# EAGLE design Adafruit Feather RP2040 Scorpio (EAGLE 9.6.2)
COMPANY: ADAFRUIT INDUSTRIES; DRAWN: KTOWN; REV: B
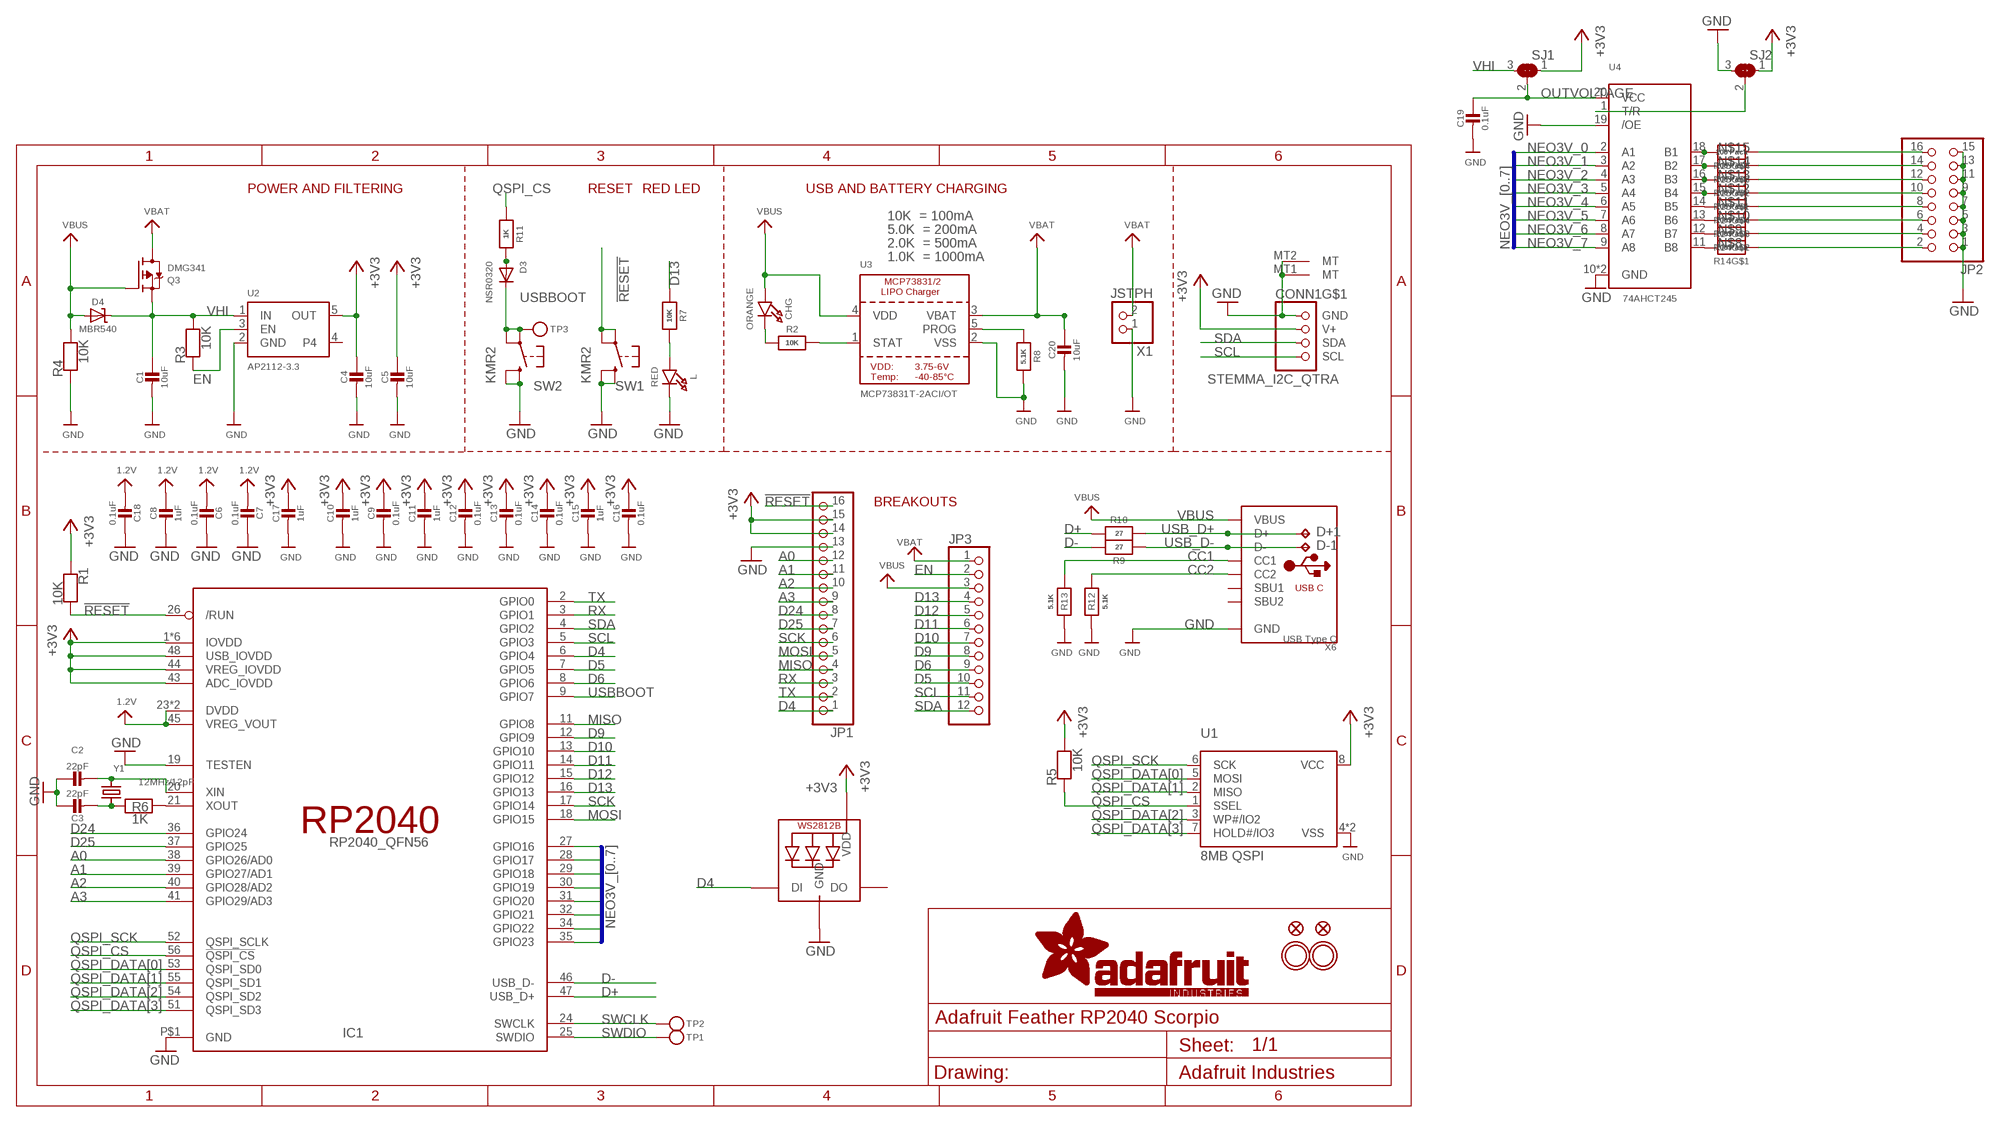
[diagram p0: schematic, sheet 1]

## Parts
C1  10uF  CAP_CERAMIC0805-NOOUTLINE  [0805-NO]
C2  22pF  CAP_CERAMIC_0402NO  [_0402NO]
C3  22pF  CAP_CERAMIC_0402NO  [_0402NO]
C4  10uF  CAP_CERAMIC0805-NOOUTLINE  [0805-NO]
C5  10uF  CAP_CERAMIC0805-NOOUTLINE  [0805-NO]
C6  0.1uF  CAP_CERAMIC_0402NO  [_0402NO]
C7  0.1uF  CAP_CERAMIC_0402NO  [_0402NO]
C8  1uF  CAP_CERAMIC0603_NO  [0603-NO]
C9  0.1uF  CAP_CERAMIC_0402NO  [_0402NO]
C10  1uF  CAP_CERAMIC0603_NO  [0603-NO]
C11  1uF  CAP_CERAMIC0603_NO  [0603-NO]
C12  0.1uF  CAP_CERAMIC_0402NO  [_0402NO]
C13  0.1uF  CAP_CERAMIC_0402NO  [_0402NO]
C14  0.1uF  CAP_CERAMIC_0402NO  [_0402NO]
C15  1uF  CAP_CERAMIC0603_NO  [0603-NO]
C16  0.1uF  CAP_CERAMIC_0402NO  [_0402NO]
C17  1uF  CAP_CERAMIC0603_NO  [0603-NO]
C18  0.1uF  CAP_CERAMIC_0402NO  [_0402NO]
C19  0.1uF  CAP_CERAMIC_0402NO  [_0402NO]
C20  10uF  CAP_CERAMIC0805-NOOUTLINE  [0805-NO]
CHG  ORANGE  LED0603_NOOUTLINE  [CHIPLED_0603_NOOUTLINE]
CONN1  STEMMA_I2C_QTRA  [JST_SH4_RA]
D3  NSR0320  DIODESOD-323F  [SOD-323F]
D4  MBR540  DIODE-SCHOTTKYSOD-123  [SOD-123]
D+1  TPB1,27  [B1,27]
D-1  TPB1,27  [B1,27]
IC1  RP2040_QFN56  [QFN56_7MM_REDUCEDEPAD]
JP1  HEADER-1X16ROUND  [1X16_ROUND]
JP2  HEADER-2X8  [2X08]
JP3  HEADER-1X12  [1X12_ROUND]
L  RED  LED0603_NOOUTLINE  [CHIPLED_0603_NOOUTLINE]
LED1  WS2812B_SK6805_1515  [SK6805_1515]
Q3  DMG341  MOSFET-P  [SOT23-R]
R1  10K  RESISTOR_0603_NOOUT  [0603-NO]
R2  10K  RESISTOR_0603_NOOUT  [0603-NO]
R3  10K  RESISTOR_0603_NOOUT  [0603-NO]
R4  10K  RESISTOR_0603_NOOUT  [0603-NO]
R5  10K  RESISTOR_0603_NOOUT  [0603-NO]
R6  1K  RESISTOR_0603_NOOUT  [0603-NO]
R7  10K  RESISTOR_0603_NOOUT  [0603-NO]
R8  5.1K  RESISTOR_0603_NOOUT  [0603-NO]
R9  27  RESISTOR_0603_NOOUT  [0603-NO]
R10  27  RESISTOR_0603_NOOUT  [0603-NO]
R11  1K  RESISTOR_0603_NOOUT  [0603-NO]
R12  5.1K  RESISTOR_0603_NOOUT  [0603-NO]
R13  5.1K  RESISTOR_0603_NOOUT  [0603-NO]
R14  100 Pack  RESISTOR_4PACK_0804  [RESPACK_4X0402]
R15  100 Pack  RESISTOR_4PACK_0804  [RESPACK_4X0402]
SJ1  SOLDERJUMPER_2WAY  [SOLDERJUMPER_2WAY_OPEN_NOPASTE]
SJ2  SOLDERJUMPER_2WAY  [SOLDERJUMPER_2WAY_OPEN_NOPASTE]
SW1  KMR2  SWITCH_TACT_SMT4.6X2.8  [BTN_KMR2_4.6X2.8]
SW2  KMR2  SWITCH_TACT_SMT4.6X2.8  [BTN_KMR2_4.6X2.8]
TP1  TESTPOINTROUND1.5MMNO  [TESTPOINT_ROUND_1.5MM_NO]
TP2  TESTPOINTROUND1.5MMNO  [TESTPOINT_ROUND_1.5MM_NO]
TP3  TESTPOINTROUND1.5MMNO  [TESTPOINT_ROUND_1.5MM_NO]
U1  8MB QSPI  SPIFLASH_8PIN_4X4  [USON8_4X4]
U2  AP2112-3.3  VREG_SOT23-5  [SOT23-5]
U3  MCP73831T-2ACI/OT  MCP73831/2  [SOT23-5]
U4  74AHCT245  74LCX245_QFN20  [20-DHVQFN]
U$31  MOUNTINGHOLE2.5  [MOUNTINGHOLE_2.5_PLATED]
U$32  MOUNTINGHOLE2.5  [MOUNTINGHOLE_2.5_PLATED]
U$34  FIDUCIAL_1MM  [FIDUCIAL_1MM]
U$35  FIDUCIAL_1MM  [FIDUCIAL_1MM]
X1  JSTPH  CON_JST_PH_2PIN_BATT  [JSTPH2_BATT]
X6  USB Type C  USB_C  [USB_C_CUSB31-CFM2AX-01-X]
Y1  12MHz/12pF  CRYSTAL2.5X2.0  [CRYSTAL_2.5X2]

## Nets
1.2V: C6.2 C7.2 C8.1 C18.2 IC1.23(DVDD) IC1.45(VREG_VOUT) IC1.50(DVDD)
!RESET: IC1.26(/RUN) JP1.16 R1.2 SW1.A'(P1) SW1.A(P)
+3V3: C4.1 C5.1 C9.1 C10.1 C11.1 C12.1 C13.1 C14.1 C15.1 C16.1 C17.1 CONN1.2(V+) IC1.1(IOVDD) IC1.10(IOVDD) IC1.22(IOVDD) IC1.33(IOVDD) IC1.42(IOVDD) IC1.43(ADC_IOVDD) IC1.44(VREG_IOVDD) IC1.48(USB_IOVDD) IC1.49(IOVDD) JP1.14 JP1.15 LED1.2(VDD) R1.1 R5.2 SJ1.1 SJ2.1 U1.8(VCC) U2.5(OUT)
A0: IC1.38(GPIO26/AD0) JP1.12
A1: IC1.39(GPIO27/AD1) JP1.11
A2: IC1.40(GPIO28/AD2) JP1.10
A3: IC1.41(GPIO29/AD3) JP1.9
CC1: R13.2 X6.A5(CC1)
CC2: R12.2 X6.B5(CC2)
D4: IC1.6(GPIO4) JP1.1 LED1.1(DI)
D5: IC1.7(GPIO5) JP3.10
D6: IC1.8(GPIO6) JP3.9
D9: IC1.12(GPIO9) JP3.8
D10: IC1.13(GPIO10) JP3.7
D11: IC1.14(GPIO11) JP3.6
D12: IC1.15(GPIO12) JP3.5
D13: IC1.16(GPIO13) JP3.4 R7.1
D24: IC1.36(GPIO24) JP1.8
D25: IC1.37(GPIO25) JP1.7
D+: IC1.47(USB_D+) R10.2
D-: IC1.46(USB_D-) R9.2
EN: JP3.2 R3.1 U2.3(EN)
GND [power]: C1.2 C2.1 C3.1 C4.2 C5.2 C6.1 C7.1 C8.2 C9.2 C10.2 C11.2 C12.2 C13.2 C14.2 C15.2 C16.2 C17.2 C18.1 C19.2 C20.2 CONN1.1(GND) CONN1.MT1(MT) CONN1.MT2(MT) IC1.19(TESTEN) IC1.P$1(GND) JP1.13 JP2.1 JP2.3 JP2.5 JP2.7 JP2.9 JP2.11 JP2.13 JP2.15 L.C LED1.4(GND) R4.1 R8.2 R12.1 R13.1 SJ2.3 SW1.B'(S1) SW1.B(S) SW2.B'(S1) SW2.B(S) U1.4(VSS) U1.PAD(VSS) U2.2(GND) U3.2(VSS) U4.10(GND) U4.19(/OE) U4.21(GND) X1.1 X6.A1B12(GND) X6.B1A12(GND)
MISO: IC1.11(GPIO8) JP1.4
MOSI: IC1.18(GPIO15) JP1.5
N$1: CHG.C R2.1
N$2: L.A R7.2
N$3: R2.2 U3.1(STAT)
N$4: R8.1 U3.5(PROG)
N$5: C2.2 IC1.20(XIN) Y1.3
N$6: C3.2 R6.1 Y1.1
N$7: IC1.21(XOUT) R6.2
N$8: R14.8 U4.11(B8)
N$9: R14.7 U4.12(B7)
N$10: R14.6 U4.13(B6)
N$11: R14.5 U4.14(B5)
N$12: R15.8 U4.15(B4)
N$13: R15.7 U4.16(B3)
N$14: R15.6 U4.17(B2)
N$15: R15.5 U4.18(B1)
N$16: D3.A R11.2
N$19: SJ2.2 U4.1(T/R)
NEO0: JP2.16 R15.4
NEO1: JP2.14 R15.3
NEO2: JP2.12 R15.2
NEO3: JP2.10 R15.1
NEO3V_0: IC1.27(GPIO16) U4.2(A1)
NEO3V_1: IC1.28(GPIO17) U4.3(A2)
NEO3V_2: IC1.29(GPIO18) U4.4(A3)
NEO3V_3: IC1.30(GPIO19) U4.5(A4)
NEO3V_4: IC1.31(GPIO20) U4.6(A5)
NEO3V_5: IC1.32(GPIO21) U4.7(A6)
NEO3V_6: IC1.34(GPIO22) U4.8(A7)
NEO3V_7: IC1.35(GPIO23) U4.9(A8)
NEO4: JP2.8 R14.4
NEO5: JP2.6 R14.3
NEO6: JP2.4 R14.2
NEO7: JP2.2 R14.1
OUTVOLTAGE: C19.1 SJ1.2 U4.20(VCC)
QSPI_CS: IC1.56(!QSPI_CS) R5.1 R11.1 U1.1(SSEL)
QSPI_DATA[0]: IC1.53(QSPI_SD0) U1.5(MOSI)
QSPI_DATA[1]: IC1.55(QSPI_SD1) U1.2(MISO)
QSPI_DATA[2]: IC1.54(QSPI_SD2) U1.3(WP#/IO2)
QSPI_DATA[3]: IC1.51(QSPI_SD3) U1.7(HOLD#/IO3)
QSPI_SCK: IC1.52(QSPI_SCLK) U1.6(SCK)
RX: IC1.3(GPIO1) JP1.3
SCK: IC1.17(GPIO14) JP1.6
SCL: CONN1.4(SCL) IC1.5(GPIO3) JP3.11
SDA: CONN1.3(SDA) IC1.4(GPIO2) JP3.12
SWCLK: IC1.24(SWCLK) TP2.P$1
SWDIO: IC1.25(SWDIO) TP1.P$1
TX: IC1.2(GPIO0) JP1.2
USB_D+: D+1.TP R10.1 X6.A6(D+) X6.B6(D+)
USB_D-: D-1.TP R9.1 X6.A7(D-) X6.B7(D-)
USBBOOT: D3.C IC1.9(GPIO7) SW2.A'(P1) SW2.A(P) TP3.P$1
VBAT [power]: C20.1 JP3.1 Q3.3(D) U3.3(VBAT) X1.2
VBUS [power]: CHG.A D4.A JP3.3 Q3.1(G) R4.2 U3.4(VDD) X6.A4B9(VBUS) X6.B4A9(VBUS)
VHI: C1.1 D4.C Q3.2(S) R3.2 SJ1.3 U2.1(IN)
Unconnected: LED1.3(DO) U2.4 X6.A8(SBU1) X6.B8(SBU2)

## Buses
NEO3V_[0..7]

## Notes on the sheet
- POWER AND FILTERING | RESET | RED LED | USB AND BATTERY CHARGING
- 10K  = 100mA
- 5.0K  = 200mA
- 2.0K  = 500mA
- 1.0K  = 1000mA
- BREAKOUTS

## Library data of the parts
C1-C3 C5-C20 = microbuilder:CAP_CERAMIC: Ceramic Capacitors For new designs, use the packages preceded by an '_' character since they are more reliable: The following footprints should be used on most boards: _0402 - Standard footprint for regular board layouts _0603 - Standard footprint for regular board layouts _0805 - Standard footprint for regular board layouts _1206 - Standard footprint for regular board layouts For extremely tight-pitch boards where space is at a premium, the following 'micro-pitch' footprints can be used (smaller pads, no silkscreen outline, etc.): _0402MP - Micro-pitch footprint for very dense/compact boards _0603MP - Micro-pitch footprint for very dense/compact boards _0805MP - Micro-pitch footprint for very dense/compact boards _1206MP - Micro-pitch footprint for very dense/compact boards
C4 = microbuilder:CAP_CERAMIC: Ceramic Capacitors For new designs, use the packages preceded by an '_' character since they are more reliable: The following footprints should be used on most boards: _0402 - Standard footprint for regular board layouts _0603 - Standard footprint for regular board layouts _0805 - Standard footprint for regular board layouts _1206 - Standard footprint for regular board layouts For extremely tight-pitch boards where space is at a premium, the following 'micro-pitch' footprints can be used (smaller pads, no silkscreen outline, etc.): _0402MP - Micro-pitch footprint for very dense/compact boards _0603MP - Micro-pitch footprint for very dense/compact boards _0805MP - Micro-pitch footprint for very dense/compact boards _1206MP - Micro-pitch footprint for very dense/compact boards; REV: A
CHG L = microbuilder:LED: LED 0603 - 0603 Surface Mount Package 2mA: Green LED - Low Power (3.9mcd, 2ma, 1.7Vf) - Digikey: 475-2709-2-ND Orange LED - Low Power (9.8mcd, 2ma, 1.8Vf) - Digikey: 475-1194-2-ND Red LED - Low Power (5mcd, 2ma, 1.8Vf) - Digikey: 475-1195-2-ND Yellow LED - Low Power (7mcd, 2ma, 1.8Vf) - Digikey: 475-1196-2-ND 5mA: Blue LED - Low Power (17mcd, 5ma, 2.9Vf) - Digikey: LNJ937W8CRACT-ND 0805 - 0805 Surface Mount Package 2mA: Red LED (8.8mcd, 2mA, 1.8Vf, Clear) - Low Power [Digikey: 475-2510-1-ND] Green LED (5mcd, 2mA, 1.8Vf, Clear) - Low Power [Digikey: 475-2730-1-ND] Yellow LED (11.3mcd, 2mA, 1.8Vf, Clear) - Low Power [Digikey: 475-2555-1-ND] 20mA: Red LED (104mcd, 20mA, Diffused) - LS R976 [Digikey: 475-1278-6-ND] Red LED (12mcd, 20mA, 2.0Vf, Clear) - APT2012EC [Digikey: 754-1128-1-ND] Green LED (15mcd, 20mA, 2.2Vf, Clear) - APT2012GC [Digikey: 754-1131-1-ND] Orange LED (160mcd, 20mA, 2.1Vf, Clear) - APT2012SECK [Digikey: 754-1130-1-ND] 1206 - 1206 Surface Mount Package Green LED (26mcd, 20mA, Diffused) - LG N971 [Digikey: 475-1407-6-ND] Red LED (15mcd, 20mA, Diffused) - LH N974 [Digikey: 475-1416-6-ND] Cree - Cree High-Power Surface Mount LEDs XPEBWT-L1-0000-00D50 - White 111lm 350mA 2.9Vf 6200K 110° XTEAWT-00-0000-00000LEE3 - White 114lm 350mA 2.85Vf 5000K 115° Everlight - Everlight 45-21 Series Surface Mount LEDs 45-21/QK2C-B2832AC2CB2/2T - Warm White 2000mcd 20mA 3.25Vf 3050K 120° 45-21/LK2C-B38452C4CB2/2T - Nuetral White 2000mcd 20mA 3.25Vf 4150K 120° 45-21/LK2C-B50634C6CB2/2T - Cold White 2200mcd 20mA 3.25Vf 5650K 120° PLCC2 Reverse Mount LS T77K-J1L2-1-0-2-R18-Z - Red 11.25mcd 2mA 1.8Vf 630nm 120° LO T77K-L1M2-24-Z - Orange 19.6mcd 2mA 1.8Vf 606nm 120° LY T77K-K2M1-26-Z - Yellow 15.7mcd 2mA 1.8Vf 587nm 120°; ROT: 270
CONN1 = adafruit_electromech:STEMMA_I2C; LCSC: C145961
D3 = adafruit:DIODE: Diode SMADIODE - SMA Surface Mount Package 20V 1A Schottky Diode Digikey: 641-1014-6-ND DO-1N4148 - Through Hole Small Current Diode SOD-123 20V 1 A (.5mV Vf) Schottky Diode - Digikey: MBRX120TPMSCT-ND SOD-323 10V 570mA (.38mV Vf, 3ns) Schottky Diode - Digikey: ZLLS410CT-ND SOD-523 30V 30mA Schottky Diode (RB751S-40TE61) - Digikey: RB751S-40TE61CT-ND SOT23-R/W - SOT23 Package (R = Solder Paste/Reflow Ovens, W = Hand-Soldering) BAT54Film 40V 300mA - Digikey: 497-7162-1-ND
D4 = microbuilder:DIODE-SCHOTTKY
D+1 D-1 = testpad:TP: Test pad
IC1 = adafruit_micro:RP2040; LCSC: C2040
JP1 = microbuilder:HEADER-1X16: PIN HEADER
JP2 = microbuilder:HEADER-2X8
JP3 = microbuilder:HEADER-1X12
LED1 = microbuilder:WS2812B; LCSC: C2890035
Q3 = microbuilder:MOSFET-P: P-Channel Mosfet LEGEND VDS: Voltage Drain-Source ID: Drain Current RDS(ON): Drain-Source On-State Resistance VGS(TH): Gate-Source Threshold Voltage CISS: Drain-Source Input Capacitance SOT-23 Name VDS ID RDS(ON) VGS(TH) CISS Order Number IRLML5103 30V 760mA 600 mOhm -- 75pF @ 25V Digikey: IRLML5103PBFCT-ND IRLML6401 12V 4.3A 50 mOhm 950mV @ 250µA 830pF @ 10V Digikey: IRLML6401PBFTR-ND NTR0202PL 20V 400mA 800 mOhm 2.3V @ 250uA 70pF @ 5V Digikey: NTR0202PLT1GOSTR-ND NTR4101PT1G 20V 1.8A 85 mOhm 1.2V @ 250uA 675pF @ 10V Digikey: NTR4101PT1GOSCT-ND DMP2004K 20V 600mA 900 mOhm 1V @ 250uA 175pF @ 16V Digikey: DMP2004KDICT-ND PMV65XP 20V 3.9A 76 mOhm 950mV @ 1mA 725pF @ 20V Digikey: 568-2358-2-ND TO-252 Name VDS ID RDS(ON) VGS(TH) CISS Order Number AOD417 30V 25A 34 mOhm 3V @ 250µA 920pF @ 15V Digikey: 785-1106-2-ND PowerPak Name VDS ID RDS(ON) VGS(TH) CISS Order Number AON7401 30V 12A 14 mOhm 3V @ 250µA 2600pF @ 15V Digikey: 785-1302-1-ND
R1-R13 = microbuilder:RESISTOR: Resistors For new designs, use the packages preceded by an '_' character since they are more reliable: The following footprints should be used on most boards: _0402 - Standard footprint for regular board layouts _0603 - Standard footprint for regular board layouts _0805 - Standard footprint for regular board layouts _1206 - Standard footprint for regular board layouts For extremely tight-pitch boards where space is at a premium, the following 'micro-pitch' footprints can be used (smaller pads, no silkscreen outline, etc.): _0402MP - Micro-pitch footprint for very dense/compact boards _0603MP - Micro-pitch footprint for very dense/compact boards _0805MP - Micro-pitch footprint for very dense/compact boards _1206MP - Micro-pitch footprint for very dense/compact boards
R14 R15 = microbuilder:RESISTOR_4PACK: Resistor Packs (4 resistors) 4 x 0603 10K 1/16W - Digikey: YC164J-10KCT-ND
SJ1 SJ2 = microbuilder:SOLDERJUMPER_2WAY: 2-Way Solder Jumper
SW1 SW2 = adafruit_electromech:SWITCH_TACT_SMT: SMT Tact Switches 6x6mm - Digikey: P12940SCT-ND KMR2 (4.6x2.8mm) - Digikey: 401-1426-1-ND EVQ-PQHB55 - Light Touch, 160GF (4.5x4.5mm) - Digikey: P8090SCT-ND KMT0 - KMT021 NGJ LHS (etc.) IP68/Waterproof - Digikey: CKN10289CT-ND
TP1-TP3 = microbuilder:TESTPOINT: Test Point Various test points for characterisation and PCB testing TESTPOINT_SMT - Compact Surface Mount Test Point [Digikey: 5016KTR-ND]
U1 = microbuilder:SPIFLASH_8PIN: SOIC8 SPI Flash Be careful with the size since SOIC8 flash comes in several 'widths' SOIC8 150 mil M25P16 - 16Mbit (2Mbit x 8) Serial Flash (75MHz SPI Bus), Supply: 2.7-3.6V Digikey: SOIC8 - M25P16-VMN6P-ND SOIC8 208 mil W25Q16BVSSIG - 16Mbit (2Mbit x 8) Serial Flash (104MHz SPI Bus), Supply: 2.7-3.6V Digikey: SOIC8 - W25Q16BVSSIG-ND
U2 = adafruit_power:VREG_SOT23-5: SOT23-5 Fixed Voltage Regulators Part Current Out V Out V In V Dropout θJA (°C/W) TJ (°C) Digikey Part No. ADP121 150mA 3.3V 3.4-5.5V 0.09V @ 150mA -- -- ADP121-AUJZ33R7CT-ND ADP121 150mA 3.0V 3.1-5.5V 0.09V @ 150mA -- -- ADP121-AUJZ30R7CT-ND ADP122 300mA 3.3V 3.4-5.5V 0.085V @ 300mA -- -- ADP122AUJZ-3.3-R7CT-ND ADP1712 300mA 3.3V 3.5-5.5V 0.17V @ 300mA -- -- ADP1712AUJZ-3.3-R7TR-ND AP7311 (Low Cost) 150mA 3.3V 3.5-6V 0.15V @ 150mA -- -- AP7311-33WG-7DICT-ND LD39015M18R 150mA 1.8V 1.9V-5.5V 0.08V @ 100mA -- -- 497-6977-1-ND LP2985A-33DBVR 150mA 3.3V 3.3-16V 0.28V @ 150mA 206 150 296-18479-1-ND MCP1824T-3302E/OT 300mA 3.3V 3.5V-6V 0.2V @ 300mA -- -- MCP1824T-3302E/OTCT-ND MIC5205-2.5YM5 TR 150mA 2.5V 2.7-16V 0.165V @ 150mA -- -- 576-1257-2-ND MIC5205-3.0YM5 TR 150mA 3.0V 3.2V-16V 0.165V @ 150mA -- -- 576-1258-2-ND MIC5205-3.3YM5 TR 150mA 3.3V 3.5V-16V 0.165V @ 150mA -- -- 576-1259-2-ND TPS780330220 150mA 3.3V+2.2V 3.6-5.5V 250mV Max -- -- 296-23332-1-ND TDA3663/N1,135 100mA 3.3V 3.5-45V 0.18V @ 50mA -- -- 568-5343-1-ND Max operating temp can be calculated using θJA, TJ (max junction temperature), and power in watts. Set the "Maximum Ambient Temperature" until it reaches TJ ("Max Junction Temperature"), which is the absolute limit for safe use of the regulator: Heat Sink Temperature Calculator <http://www.daycounter.com/Calculators/Heat-Sink-Temperature-Calculator.phtml> For example, With 12V source into a 3.3V LP2985 and a 30mA load, we are dissipating (12V-3.3V) * 0.03A = 0.261W. With a θJA of 206 °C/W, a TJ of 150°C, and 261mW we can safely use the chip without a heat sink up to 75°C (=147.1°C Junction Temperature).; JLC_ROTATION: 0
U3 = microbuilder:MCP73831/2: MCP73831/2 LIPO Charger VDD: 3.75 - 6V Temp -40 - 85°C Programmable Charge Rate: 15-500mA NOTE: STAT is a tri-state logic output on the MCP73831 and an open-drain output on the MCP73832. SOT23-5 with 4.2V output and tri-state logic on STAT = MCP73831T-2ACI/OT; JLC_ROTATION: 270; LCSC: C424093
U4 = microbuilder:74LCX245: 74LCX245MTC - 5.0V Tolerant Bi-Directional Buffer Can be used to interface 5.0V logic to 2.5 or 3.3V devices Digikey: 74LCX245MTCXTR-ND Mouser: 512-74LCX245MTCX
U$31 U$32 = adafruit_electromech:MOUNTINGHOLE: Mounting Hole For #2 screws (0.086"/2.18mm width, 0.094"/2.4mm hole) use 2.5mm; BOM: EXCLUDE
U$34 U$35 = microbuilder:FIDUCIAL: Fiducial Alignment Points Various fiducial points for machine vision alignment.; BOM: EXCLUDE
X1 = adafruit_electromech:CON_JST_PH_2PIN: JST 2-Pin Right-Angle Connector PH-Series - 4UConnector: 17311 SH-Series - 4UConnector: 07278; LCSC: C47647
X6 = adafruit_electromech:USB_C: USB Type-C USB 2.0 Connector; LCSC: C165948
Y1 = microbuilder:CRYSTAL: Crystals HC49UP - Surface Mount Crystal 4.0MHz 18pF +/-30ppm Surface Mount Crystal [Digikey: 535-9857-1-ND] 12.0 MHz Surface Mount Crystal [Digikey: 535-9869-6-ND] 25.0 MHz Surface Mount Crystal [Digikey: 535-9078-1-ND] 2.5 x 2.0mm - MEMs SMT Crystal 16.0 MHz 10pF 20ppm 2.5 x 2.0mm Crystal [Digikey -40-85°C: 535-10923-1-ND] 3.2 x 2.5mm - MEMs SMT Crystal 12.0 MHz 8pF 15ppm 3.2 x 2.5mm Crystal [Digikey: -10-70°C: 644-1047-1-ND -40-125°C: 644-1128-1-ND] 40~85°C cheaper: 644-1173-6-ND 16.0 MHz 8pF 15ppm 3.2 x 2.5mm Crystal [Digikey: -10-70°C: 644-1049-1-ND -40-125°C: 644-1129-2-ND]-40~85°C cheaper: 644-1175-6-ND 16.0 MHz 10pF 10ppm 3.2 x 2.5mm Crystal [Digikey: 644-1100-1-ND] 27.12 MHz 18pF 30ppm 3.2 x 2.5mm Crystal [Digikey: 887-1424-1-ND] 27.12MHz 10pF 10ppm 3.2 x 2.5mm Crystal [Digikey: 887-1329-1-ND] 4.9 x 1.8mm - MEMs SMT Crystal 32.768 KHz 12.5pF 20ppm 4.9 x 1.8mm Crystal [Digikey: SE2415CT-ND] 8.0 x 3.8mm - Surface Mount Crystal 32.768kHz 12.5pF 20ppm -40°C-85°C [Digikey: 535-9166-2-ND] Cylinder 32.768KHz Cylinder Crystal (2x6mm body) [Ex. Digikey: 300-8341-2-ND]

## Net classes
1 power: width 0.305 mm
2 gnd: width 0.254 mm

## Board
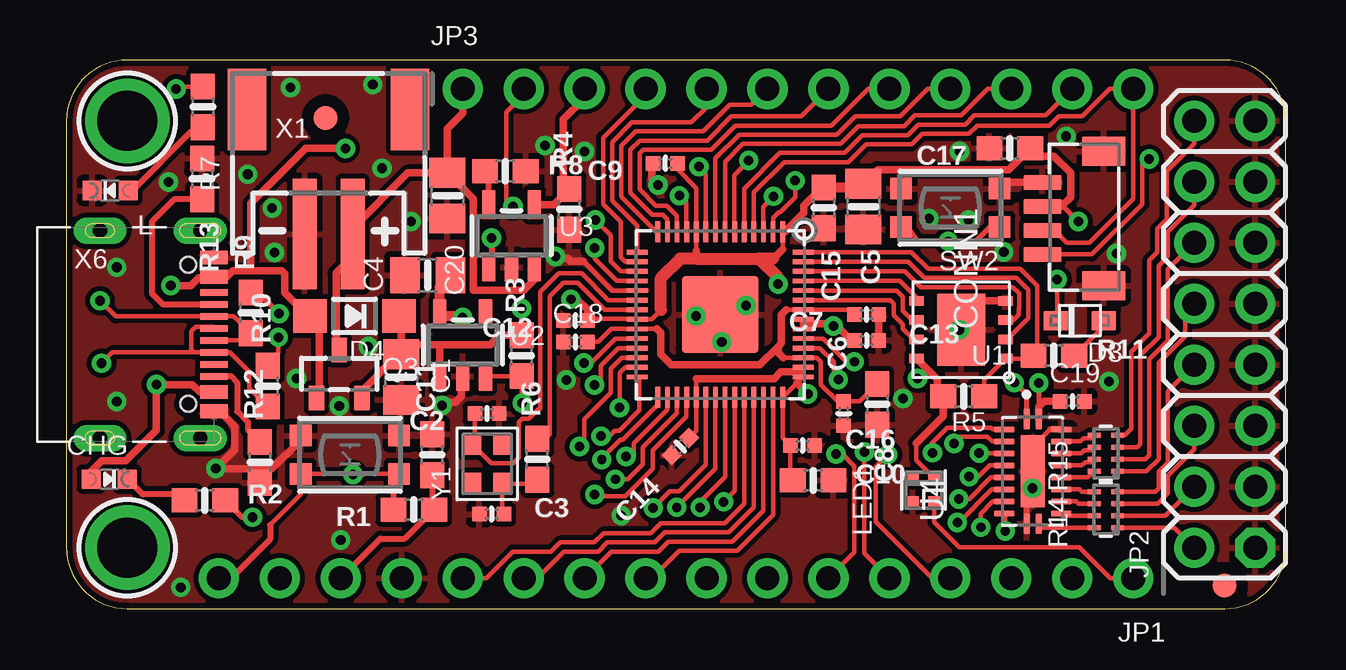
[diagram p1: board, top side]
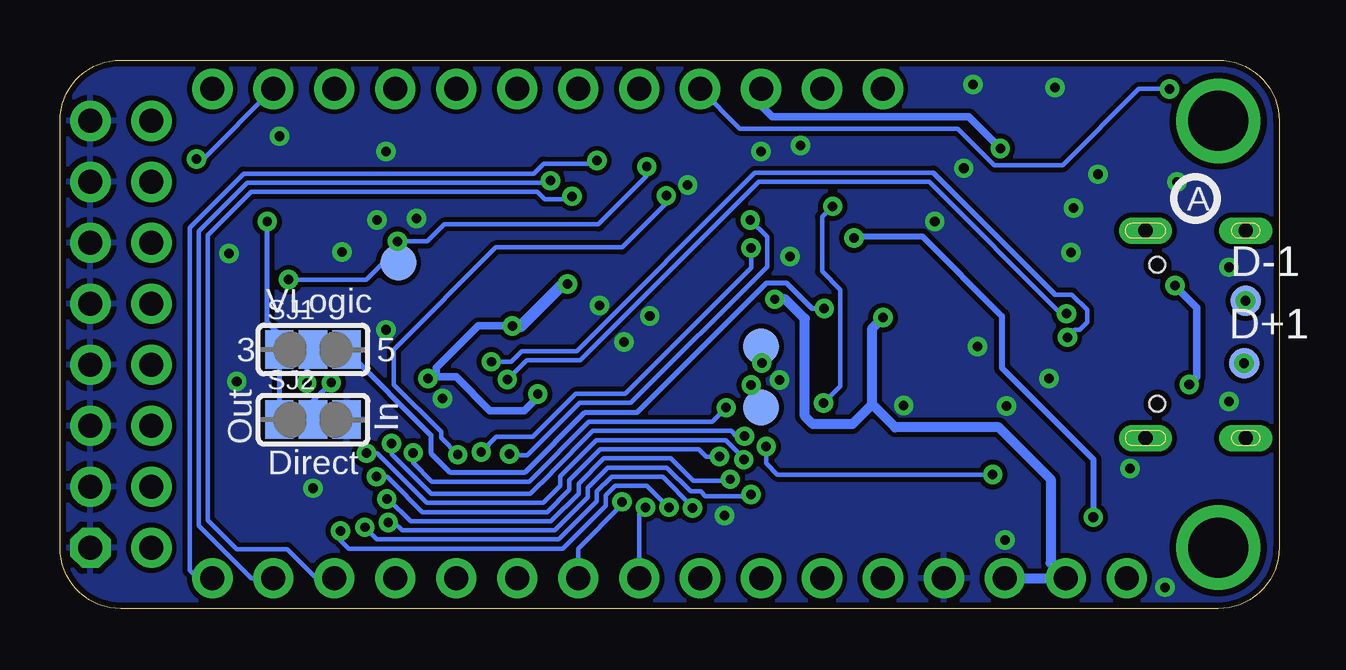
[diagram p2: board, bottom side, seen from below]

Size 50.8 x 22.86 mm. Coordinates in mm from the lower left corner, seen from the top.
Outline: 2.54,0 48.26,0 arc90 50.8,2.54 50.8,20.32 arc90 48.26,22.86 2.54,22.86 arc90 0,20.32 0,2.54 arc90 2.54,0
Copper layers (1*16): Top 0.035mm / dielectric 1.5mm / Bottom 0.035mm
Design rules "adafruit 7-7 *": minimum track width 7mil, minimum drill 15.5mil, track to track 8mil, track to pad 7mil, pad to pad 7mil, via to via 7mil, smd to smd 7mil, copper to edge 10mil, drill to drill 8mil, minimum pad ring 10mil, minimum via ring 8mil, stop-mask expansion 2mil, vias tented up to drill 20mil, thermal gap 10mil

### Footprints (pad centres in the part's own frame; a part is rotated, then mirrored left to right if it is on the bottom)
0805-NO = smd 1.24 x 1.5: 1 -0.95,0; 2 0.95,0
_0402NO = smd 0.6 x 0.6: 1 -0.508,0; 2 0.508,0
0603-NO = smd 1.075 x 1: 1 -0.85,0; 2 0.85,0
CHIPLED_0603_NOOUTLINE = smd 0.8 x 0.8: A 0,-0.75; C 0,0.75
JST_SH4_RA = smd 0.6 x 1.55: 1 1.5,0.924; 2 0.5,0.924; 3 -0.5,0.924; 4 -1.5,0.924 | smd 1.2 x 1.8: MT1 -2.8,-1.624; MT2 2.8,-1.624
SOD-323F = smd 1 x 0.8: A -1,0; C 1,0
SOD-123 = smd 1.4 x 1.4: A 1.85,0; C -1.85,0
B1,27 = smd 1.27 x 1.27: TP 0,0
QFN56_7MM_REDUCEDEPAD = smd 0.875 x 0.2: 1 -3.45,2.6; 2 -3.45,2.2; 3 -3.45,1.8; 4 -3.45,1.4; 5 -3.45,1; 6 -3.45,0.6; 7 -3.45,0.2; 8 -3.45,-0.2; 9 -3.45,-0.6; 10 -3.45,-1; 11 -3.45,-1.4; 12 -3.45,-1.8; 13 -3.45,-2.2; 14 -3.45,-2.6; 29 3.45,-2.6; 30 3.45,-2.2; 31 3.45,-1.8; 32 3.45,-1.4; 33 3.45,-1; 34 3.45,-0.6; 35 3.45,-0.2; 36 3.45,0.2; 37 3.45,0.6; 38 3.45,1; 39 3.45,1.4; 40 3.45,1.8; 41 3.45,2.2; 42 3.45,2.6 | smd 0.2 x 0.875: 15 -2.6,-3.45; 16 -2.2,-3.45; 17 -1.8,-3.45; 18 -1.4,-3.45; 19 -1,-3.45; 20 -0.6,-3.45; 21 -0.2,-3.45; 22 0.2,-3.45; 23 0.6,-3.45; 24 1,-3.45; 25 1.4,-3.45; 26 1.8,-3.45; 27 2.2,-3.45; 28 2.6,-3.45; 43 2.6,3.45; 44 2.2,3.45; 45 1.8,3.45; 46 1.4,3.45; 47 1,3.45; 48 0.6,3.45; 49 0.2,3.45; 50 -0.2,3.45; 51 -0.6,3.45; 52 -1,3.45; 53 -1.4,3.45; 54 -1.8,3.45; 55 -2.2,3.45; 56 -2.6,3.45 | smd 3.2 x 3.2: P$1 0,0
1X16_ROUND = drill 1 pad 1.676: 1 -19.05,0; 2 -16.51,0; 3 -13.97,0; 4 -11.43,0; 5 -8.89,0; 6 -6.35,0; 7 -3.81,0; 8 -1.27,0; 9 1.27,0; 10 3.81,0; 11 6.35,0; 12 8.89,0; 13 11.43,0; 14 13.97,0; 15 16.51,0; 16 19.05,0
2X08 = drill 1 pad 1.676 octagon: 1 -8.89,-1.27 | drill 1 pad 1.676: 2 -8.89,1.27; 3 -6.35,-1.27; 4 -6.35,1.27; 5 -3.81,-1.27; 6 -3.81,1.27; 7 -1.27,-1.27; 8 -1.27,1.27; 9 1.27,-1.27; 10 1.27,1.27; 11 3.81,-1.27; 12 3.81,1.27; 13 6.35,-1.27; 14 6.35,1.27; 15 8.89,-1.27; 16 8.89,1.27
1X12_ROUND = drill 1 pad 1.676: 1 -13.97,0; 2 -11.43,0; 3 -8.89,0; 4 -6.35,0; 5 -3.81,0; 6 -1.27,0; 7 1.27,0; 8 3.81,0; 9 6.35,0; 10 8.89,0; 11 11.43,0; 12 13.97,0
SK6805_1515 = smd 0.5 x 0.5: 1 -0.5,-0.45; 2 0.5,-0.45; 3 0.5,0.45; 4 -0.5,0.45
SOT23-R = smd 0.635 x 1.016: 1 -0.95,-1; 2 0.95,-1; 3 0,1
RESPACK_4X0402 = smd 0.203 x 0.533: 1 -0.75,-0.486; 2 -0.25,-0.486; 3 0.25,-0.486; 4 0.75,-0.486; 5 0.75,0.486; 6 0.25,0.486; 7 -0.25,0.486; 8 -0.75,0.486
SOLDERJUMPER_2WAY_OPEN_NOPASTE = smd 1.168 x 1.6: 1 -1.397,0; 2 0,0; 3 1.397,0
BTN_KMR2_4.6X2.8 = smd 0.9 x 0.9: A 2.05,0.8; A' -2.05,0.8; B 2.05,-0.8; B' -2.05,-0.8
TESTPOINT_ROUND_1.5MM_NO = smd 1.5 x 1.5: P$1 0,0
USON8_4X4 = smd 0.6 x 0.4: 1 -1.85,1.2; 2 -1.85,0.4; 3 -1.85,-0.4; 4 -1.85,-1.2; 5 1.85,-1.2; 6 1.85,-0.4; 7 1.85,0.4; 8 1.85,1.2 | smd 2 x 3: PAD 0,0
SOT23-5 = smd 0.55 x 1.2: 1 -0.95,-1.3; 2 0,-1.3; 3 0.95,-1.3; 4 0.95,1.3; 5 -0.95,1.3
20-DHVQFN = smd 0.26 x 0.86: 1 -0.25,2.185; 10 -0.25,-2.185; 11 0.25,-2.185; 20 0.25,2.185 | smd 0.86 x 0.26: 2 -1.185,1.75; 3 -1.185,1.25; 4 -1.185,0.75; 5 -1.185,0.25; 6 -1.185,-0.25; 7 -1.185,-0.75; 8 -1.185,-1.25; 9 -1.185,-1.75; 12 1.185,-1.75; 13 1.185,-1.25; 14 1.185,-0.75; 15 1.185,-0.25; 16 1.185,0.25; 17 1.185,0.75; 18 1.185,1.25; 19 1.185,1.75 | smd 1 x 3: 21 0,0
MOUNTINGHOLE_2.5_PLATED = drill 2.5 pad 3.2: P$1 0,0
FIDUCIAL_1MM = smd 1 x 1: 1 0,0
JSTPH2_BATT = smd 1 x 4.6: 1 -1,-2.049; 2 1,-2.049 | smd 1.6 x 3.4: NC1 -3.4,3.151; NC2 3.4,3.151
USB_C_CUSB31-CFM2AX-01-X = smd 0.575 x 1.15: A1B12 -3.2,2.275; A4B9 -2.4,2.275; B1A12 3.2,2.275; B4A9 2.4,2.275 | smd 0.275 x 1.15: A5 -1.25,2.275; A6 -0.25,2.275; A7 0.25,2.275; A8 1.25,2.275; B5 1.75,2.275; B6 0.75,2.275; B7 -0.75,2.275; B8 -1.75,2.275 | drill 0.6 pad 1 long: M1 -4.32,1.7; M2 4.32,1.7; M3 -4.32,-2.48; M4 4.32,-2.48 | hole 0.65: 2.89,1.2; -2.89,1.2
CRYSTAL_2.5X2 = smd 0.9 x 0.75: 1 -0.825,-0.625; 2 0.825,-0.625; 3 0.825,0.625; 4 -0.825,0.625

### Placement (x,y rotation side)
C1  13.95,9.65 270 top
C2  17.53,8.13 180 top
C3  17.72,3.94 0 top
C4  15.05,13.89 180 top
C5  33.21,16.75 270 top
C6  32.38,8.13 90 top
C7  33.34,12.26 180 top
C8  33.78,8.51 270 top
C9  24.96,18.55 180 top
C10  31.11,5.34 0 top
C11  15.24,6.41 90 top
C12  21.21,12 180 top
C13  33.34,11.18 0 top
C14  25.58,6.76 225 top
C15  31.56,16.7 270 top
C16  30.67,6.79 0 top
C17  39.31,19.18 180 top
C18  21.21,11.11 0 top
C19  41.91,8.64 0 top
C20  15.88,17.21 270 top
CHG  1.78,5.4 270 top
CONN1  41.59,16.26 90 top
D3  42.23,12 180 top
D4  12,12.19 180 top
D+1  1.46,10.22 0 bottom
D-1  1.4,12.83 0 bottom
IC1  27.24,12.26 270 top
JP1  25.4,1.27 180 top
JP2  48.26,11.43 90 top
JP3  30.48,21.65 0 top
L  1.82,17.42 90 top
LED1  35.71,4.94 90 top
Q3  11.37,9.78 0 top
R1  14.48,4.13 180 top
R2  5.77,4.51 0 top
R3  18.96,10.54 90 top
R4  20.95,16.64 90 top
R5  37.39,8.84 180 top
R6  19.62,6.22 90 top
R7  5.69,20.9 270 top
R8  18.29,18.22 0 top
R9  7.68,12.32 90 top
R10  8.38,9.27 90 top
R11  41.15,10.54 0 top
R12  8.06,6.1 90 top
R13  5.65,17.91 270 top
R14  43.31,4.13 90 top
R15  43.31,6.48 90 top
SJ1  40.26,10.79 0 bottom
SJ2  40.26,7.87 0 bottom
SW1  11.81,6.41 180 top
SW2  36.83,16.7 180 top
TP1  21.59,8.38 0 bottom
TP2  21.59,10.92 0 bottom
TP3  36.7,14.41 0 bottom
U1  37.27,11.62 180 top
U2  16.51,10.99 0 top
U3  18.54,15.53 0 top
U4  40.26,5.71 0 top
U$12  [SCORPIO_TOP]  0,0 0 top
U$13  [PCBFEAT-REV-040]  3.49,17.08 0 bottom
U$28  [SCORPIO_BOT]  50.8,0.06 0 bottom
U$31  2.54,20.32 270 top
U$32  2.54,2.54 270 top
U$34  10.79,20.45 270 top
U$35  48.24,0.96 270 top
X1  10.92,17.65 0 top
X6  3.87,11.43 270 top
Y1  17.53,6.03 90 top

### Tracks (layer width: path | path; a pad name or v marks a point on that pad's centre or on a via)
1.2V
  Top 0.178: C7.2 32.63,12.46 IC1.50 29.99,12.46 | 29.87,10.46 IC1.45 31.25,10.46 31.43,10.28 31.43,9.34 32.13,8.64 C6.2 33.06,8.64 C8.1 | C18.2 22.16,11.11 22.7,11.65 IC1.23 24.6,11.65
  Top 0.305: 29.99,12.46 29.78,12.25 29.78,11.05 29.65,10.92 | 29.87,10.46 29.65,10.67 29.65,10.92 | 29.65,10.92 28.89,10.16 25.21,10.16 24.77,10.6 24.77,11.49 24.6,11.65
!RESET  (via drill 0.39, 0.4)
  Top 0.178: 12.38,5.61 SW1.A 9.76,4.77 8.48,3.49 | 12.38,5.61 SW1.A' | v11.94,5.59 12.36,5.59 12.38,5.61 | v21.38,6.75 21.57,6.95 21.57,7.9 22.67,9 22.67,9.99 23.14,10.46 IC1.26
  Top 0.254: JP1.16 6.86,1.27 8.48,2.9 8.48,3.49 | R1.2 13.63,5.38 SW1.A'
  Bottom 0.178: v21.38,6.75 21.38,6.06 20.91,5.59 v11.94,5.59
+3V3  (via drill 0.39, 0.4)
  Top 0.178: C9.1 25.46,18.3 26.24,17.52 IC1.10 26.24,14.91 | C10.1 30.16,5.44 C16.1 29.84,7.12 IC1.42 30.43,9.39 IC1.43 IC1.44 30.69,9.99 30.56,9.87 | C15.1 31.56,17.42 | 29.84,14.98 IC1.1 29.86,15.68 29.91,15.68 | C5.1 33.13,17.62 | IC1.48 IC1.49 30.69,11.87 | 32.69,17.55 32.72,17.58 | C17.1 40.47,18.86 | R5.2 36.4,8.84 | C14.1 26.24,7.42 IC1.33 26.24,9.59 | C12.1 21.79,12.07 23.77,12.07 IC1.22 24.38,12.06 24.77,12.44 | v21.02,12.89 21.27,12.89 | LED1.2 35.42,6.18 35.42,6.89
  Top 0.203: v42.16,16.13 41.54,16.76 41.46,16.76
  Top 0.254: JP1.14 13.08,2.92 14.1,2.92 15.3,4.13 R1.1 15.24,4.21 C11.1 | 35.56,9.59 v35.47,9.59
  Top 0.305: U2.5 15.65,12.19 | 16.45,12.19 v16.51,12.13 | 15.56,13.45 C4.1 | 29.84,14.98 29.45,14.59 | CONN1.2 41.46,16.76 41.85,17.14 41.85,18.16 41.15,18.86 40.47,18.86 | C5.1 33.8,18.29 39.27,18.29 C17.1 | 36.4,8.84 36.28,8.95 36.28,9.56 35.91,9.94 | 31.95,11.87 30.69,11.87 | C13.1 32.7,11.18 31.95,11.93 31.95,11.87 | 30.56,9.87 29.77,9.87 29.5,9.59 26.24,9.59 | 31.95,11.87 v31.95,11.78 | C12.1 21.72,12.45 21.27,12.89 | 26.24,14.91 26.24,14.61 26.23,14.59 | 29.91,15.68 30.73,16.5 30.73,16.78 31.37,17.42 31.56,17.42 | 30.43,9.39 30.45,9.39 v30.89,8.94 | U1.8 35.91,9.94 | 35.91,9.94 35.56,9.59 | R5.2 36.54,8.01 35.42,6.89
  Top 0.406: 16.45,12.19 15.65,12.19 | U2.5 15.56,13.45 | 32.72,17.58 33.13,17.62 | C15.1 32.69,17.55
  Top 0.508: 29.45,14.59 28.84,14.59 | v29.65,13.53 29.65,13.78 28.84,14.59 | 24.77,12.44 24.77,13.78 25.57,14.59 26.23,14.59 28.84,14.59
  Bottom 0.178: v31.95,11.78 31.59,11.78
  Bottom 0.203: v42.16,16.13 42.16,11.94 41.66,11.43 SJ1.1 SJ2.1
  Bottom 0.305: v30.89,8.94 30.89,8.82 31.45,8.26 32.89,8.26 34.29,9.65 35.12,9.65 | v31.95,11.78 33.37,11.78 35.12,10.03 35.12,9.65 | 35.12,9.65 35.4,9.65 v35.47,9.59
  Bottom 0.406: v16.51,12.13 16.95,11.68 16.95,8.51 | JP1.14 JP1.15 9.53,1.91 9.53,5.4 11.68,7.56 16,7.56 16.95,8.51 | 16.95,8.51 17.78,7.68 19.43,7.68 19.77,8.02 19.77,12.08 20.57,12.89 v21.02,12.89
  Bottom 0.508: 31.59,11.78 29.84,13.53 v29.65,13.53
A0
  Top 0.178: IC1.38 28.24,4.36 27.43,3.56 24.77,3.56 24.35,3.14 22.38,3.14 22,2.76 20.57,2.76 20.19,2.38 18.59,2.38 17.49,1.27 JP1.12
A1
  Top 0.178: IC1.39 28.64,4.22 27.59,3.17 24.93,3.17 24.51,2.76 22.54,2.76 22.16,2.38 20.73,2.38 19.56,1.21 19.11,1.21 JP1.11
A2
  Top 0.178: IC1.40 29.04,4.09 27.75,2.79 25.08,2.79 24.66,2.38 22.7,2.38 JP1.10
A3
  Top 0.178: IC1.41 29.44,3.91 27.94,2.41 25.53,2.41 24.38,1.27 JP1.9
CC1
  Top 0.254: R13.2 4.48,17.06 3.56,16.13 3.56,13.14 4.02,12.68 X6.A5
CC2
  Top 0.254: X6.B5 6.84,9.7 7.11,9.42 7.11,8.22 7.56,7.77 7.56,7.45 R12.2
D4  (via drill 0.39)
  Top 0.178: IC1.6 27.82,15.72 27.82,18.07 v28.43,18.67 | LED1.1 36.16,3.6 37.2,2.56 42.2,2.56 43.5,1.27 JP1.1
  Bottom 0.178: JP1.1 45.08,1.27 45.4,1.59 45.4,15.87 43.15,18.13 31.06,18.13 30.65,18.54 29.08,18.54 28.55,18.54 v28.43,18.67
D5
  Top 0.178: IC1.7 27.44,18.63 28.18,19.37 32.26,19.37 33,20.1 34.9,20.1 35.34,20.55 37.29,20.55 38.39,21.65 JP3.10
D6
  Top 0.178: JP3.9 35.88,21.65 34.73,20.51 32.87,20.51 32.11,19.75 28.02,19.75 27.04,18.77 IC1.8
D9
  Top 0.178: JP3.8 33.4,21.65 31.88,20.13 27.87,20.13 26.86,19.12 24.04,19.12 23.88,18.96 23.88,17.48 24.56,16.8 25,16.8 25.42,16.38 25.42,15.72 IC1.12
D10
  Top 0.178: JP3.7 30.61,20.51 27.71,20.51 26.7,19.5 23.88,19.5 23.5,19.12 23.5,17.32 24.41,16.41 24.85,16.41 25.04,16.22 IC1.13
D11
  Top 0.178: JP3.6 28.54,20.99 27.64,20.99 26.54,19.88 23.72,19.88 23.12,19.28 23.12,17.16 24.58,15.71 IC1.14
D12
  Top 0.178: IC1.15 23.79,15.95 22.74,17 22.74,19.44 23.56,20.26 26.04,20.26 26.67,20.9 JP3.5
D13  (via drill 0.39)
  Top 0.178: IC1.16 23.28,14.46 23.09,14.64 23.09,16.12 22.36,16.85 22.36,19.63 24.13,21.4 JP3.4 | R7.1 4.67,21.75 v4.57,21.65
  Bottom 0.178: JP3.4 22.48,20 13.4,20 11.87,18.48 9.02,18.48 5.84,21.65 v4.57,21.65
D24  (via drill 0.39)
  Top 0.178: IC1.36 27.44,5.5 26.41,4.46 v26.41,4.22
  Bottom 0.178: v26.41,4.22 26.67,3.96 JP1.8
D25  (via drill 0.39)
  Top 0.178: IC1.37 27.84,4.91 v27.38,4.45
  Bottom 0.178: v27.38,4.45 27.38,4.32 29.21,2.5 JP1.7
D+  (via drill 0.39, 0.4)
  Top 0.178: v8.83,11.31 8.83,10.67 8.38,10.22 R10.2 | v32.83,10.29 32.5,10.29 31.53,11.26 IC1.47
  Bottom 0.178: 14.41,18.16 21.84,18.16 29.27,10.73 31.56,10.73 32,10.29 v32.83,10.29 | v8.83,11.31 8.51,11.62 8.32,11.62 8,11.94 8,12.45 8.64,13.08 9.34,13.08
  Bottom 0.203: 14.41,18.16 9.34,13.08
D-  (via drill 0.39, 0.4)
  Top 0.178: v32.16,9.55 31.97,9.74 31.97,10.28 31.39,10.86 IC1.46
  Top 0.203: v8.86,12.29 7.98,13.17 R9.2
  Bottom 0.178: v32.16,9.55 31.36,10.35 29.12,10.35 21.69,17.78 14.59,17.78 9.1,12.29 v8.86,12.29
EN  (via drill 0.39)
  Top 0.178: JP3.2 19.05,21.39 18.33,20.68 18.33,16.76 v18.61,16.76 | U2.3 18.73,9.69 18.74,9.69 R3.1 18.96,8.6 v18.99,8.57
  Bottom 0.178: v18.61,16.76 19.05,16.32 19.05,14.05 18.29,13.29 18.29,9.27 v18.99,8.57
GND  (via drill 0.39, 0.4)
  Top 0.178: IC1.19 22.75,13.26 21.53,14.48 | 40.99,7.46 40.07,6.54
  Top 0.203: 40.01,5.96 U4.21
  Top 0.254: U4.19 40.99,7.46 | 40.26,6.6 U4.21 40.01,5.46 U4.10
  Top 0.305: U2.2 16.45,9.62 16.45,8.86 16.19,8.61 15.65,8.61 v15.65,8.47 | SW1.B 9.76,7.02 8.56,5.82 6.22,5.82 7.01,6.61 7.01,7.59 6.26,8.34 X6.B1A12 | v24.65,17.65 24.38,17.92 24.38,18.49 C9.2 | 21.53,14.48 21.02,14.48 20.89,14.61 20.45,14.61 v20.38,14.67 | CONN1.1 38.88,17.76 SW2.B' | C7.1 C13.2 | U1.4 37.66,12.82 37.66,12.83 37.27,12.45 U1.PAD
  other vias: 11.37,8.45 14.35,16.13 8.57,16.7 6.22,5.84 9.33,21.72 12.76,21.84 12.57,10.92 7.56,18.1 8.67,14.85 9.59,9.59 2.1,8.64 2.1,14.22 11.43,2.86 19.94,19.3 21.59,19.05 26.23,12.19 28.32,12.64 27.3,11.11 23.11,3.87 35.94,16.26 37.59,16.19 41.66,19.68 37.21,19.05 37.21,11.62 34.86,8.76 43.75,14.8 43.43,9.46 20.83,9.53 40.26,5.02 4.76,0.89 4.25,17.78 13.14,18.35 39.05,14.86
  pour Top: 0,22.86 50.8,22.86 50.8,0 0,0
  pour Bottom: 0,22.86 50.86,22.86 50.86,0 0,0
MISO  (via drill 0.39)
  Top 0.178: IC1.11 25.82,15.72 25.82,16.96 25.57,17.21 v25.54,17.21 | JP1.4 36.07,1.27 33.72,3.62 33.72,5.91 v34.23,6.41
  Bottom 0.178: v34.23,6.41 34.92,7.11 34.92,7.37 36.89,9.34 36.89,10.79 32.64,15.05 27.38,15.05 25.54,16.89 v25.54,17.21
MOSI  (via drill 0.39)
  Top 0.178: IC1.18 22.93,13.65 22.01,14.58 v22.01,15.03 | JP1.5 33.25,2.31 v33.25,6.53
  Bottom 0.178: v22.01,15.03 22.01,14.2 27.26,8.95 29.3,8.95 31.1,7.16 32.61,7.16 v33.25,6.53
N$1
  Top 0.254: R2.1 4.66,4.76 3.18,4.76 2.54,5.4 CHG.C
N$2
  Top 0.254: R7.2 5.52,19.89 5.2,19.89 2.74,17.42 L.A
N$3  (via drill 0.4)
  Top 0.254: v7.75,3.81 7.31,3.81 R2.2 | v17.72,15.44 17.72,14.65 17.59,14.53 U3.1
  Bottom 0.254: v7.75,3.81 7.75,6.22 11.56,10.03 11.56,12.19 14.87,15.51 17.65,15.51 v17.72,15.44
N$4
  Top 0.254: R8.1 17.57,18.1 17.57,16.86 U3.5
N$5
  Top 0.178: C2.2 17.02,6.97 Y1.3 17.71,6.05 18.61,6.05 18.86,6.3 18.86,7.77 18.99,7.91 19.26,7.91 19.68,8.32 19.75,8.32 19.75,13.21 20.51,13.97 21.46,13.97 22.58,12.86 IC1.20
N$6
  Top 0.178: R6.1 19.62,5.21 Y1.1 18.15,4.01 C3.2
N$7
  Top 0.178: R6.2 19.93,7.07 20.13,7.27 20.13,13.02 20.7,13.59 21.3,13.59 22.44,12.46 IC1.21
N$8
  Top 0.178: U4.11 40.66,3.38 R14.8
N$9
  Top 0.178: U4.12 41.53,3.88 R14.7
N$10
  Top 0.178: U4.13 42.08,4.46 42.17,4.38 R14.6
N$11
  Top 0.178: U4.14 42.22,4.96 42.3,4.88 R14.5
N$12
  Top 0.178: U4.15 42.56,5.46 R15.8
N$13
  Top 0.178: U4.16 42.31,5.96 42.46,6.11 42.7,6.11 R15.7
N$14
  Top 0.178: U4.17 42.27,6.46 42.42,6.61 42.7,6.61 R15.6
N$15
  Top 0.178: U4.18 42.24,6.96 42.38,7.11 42.7,7.11 R15.5
N$16
  Top 0.178: D3.A 43.23,11.77 R11.2
N$17
  Bottom 0.203: 39.37,10.79 39.75,10.79
N$18
  Bottom 0.203: 40.77,8 41.15,8
N$19  (via drill 0.39)
  Top 0.203: U4.1 40.01,8.9 v39.5,9.42
  Bottom 0.203: SJ2.2 40.26,8.65 v39.5,9.42
NEO0
  Top 0.178: R15.4 44.09,7.23 44.36,7.49 44.36,10.71 45.12,11.47 45.12,14.52 45.44,14.84 45.44,15.82 45.85,16.23 45.85,18.22 46.99,19.37 JP2.16
NEO1
  Top 0.178: R15.3 44.61,6.73 44.74,6.86 44.74,10.55 45.5,11.31 45.5,14.29 45.88,14.67 45.88,15.7 46.99,16.8 JP2.14
NEO2
  Top 0.178: R15.2 44.96,6.23 45.12,6.39 45.12,10.39 45.88,11.16 45.88,14.13 JP2.12
NEO3
  Top 0.178: R15.1 45,5.73 45.5,6.23 45.5,10.24 46.61,11.34 46.61,12.32 JP2.10
NEO3V_0  (via drill 0.39)
  Top 0.178: v23.04,8.37 v23.05,8.38 23.05,9.83 23.28,10.06 IC1.27 | U4.2 38.6,7.46 38.52,7.54 36.71,7.54 36.06,6.9 36.06,6.49 v36.08,6.49
  Bottom 0.178: v23.04,8.37 23.63,7.78 28.77,7.78 31.25,5.3 35.3,5.3 36.08,6.08 v36.08,6.49
NEO3V_1  (via drill 0.39)
  Top 0.178: IC1.28 23.87,9.57 23.87,8.26 23.03,7.41 22.85,7.41 22.62,7.18 v22.28,7.18 | U4.3 38.57,6.96 38.38,7.16 37.26,7.16 v36.98,6.88
  Bottom 0.178: v22.28,7.18 22.62,7.18 22.84,7.4 28.61,7.4 30.34,5.67 30.34,5.65 31.2,4.79 35.34,4.79 36.98,6.44 v36.98,6.88
NEO3V_2  (via drill 0.39)
  Top 0.178: IC1.29 24.64,8.49 23.18,7.03 23.07,7.03 22.3,6.27 v22.3,6.21 | v38.03,6.48 38.05,6.46 U4.4
  Bottom 0.178: v22.3,6.21 22.3,6.27 23.06,7.02 28.45,7.02 29.96,5.51 29.96,5.11 30.66,4.41 35.52,4.41 37.59,6.48 v38.03,6.48
NEO3V_3  (via drill 0.39)
  Top 0.178: IC1.30 25.04,8.29 23.64,6.88 23.64,6.34 v23.32,6.34 | v37.62,5.5 38,5.5 38.46,5.96 U4.5
  Bottom 0.178: v23.32,6.34 23.87,6.34 24.18,6.64 28.29,6.64 29.57,5.36 29.57,4.95 30.5,4.03 35.7,4.03 36.98,5.31 37.17,5.5 v37.62,5.5
NEO3V_4  (via drill 0.39)
  Top 0.178: IC1.31 25.42,8.79 25.42,8.13 24.02,6.73 24.02,6.03 23.38,5.39 v22.87,5.39 | v37.18,4.57 37.62,4.57 38.52,5.46 U4.6
  Bottom 0.178: v22.87,5.39 22.94,5.33 24.42,5.33 25.35,6.26 28.13,6.26 29.19,5.2 29.19,4.79 30.34,3.65 36.2,3.65 37.12,4.57 v37.18,4.57
NEO3V_5  (via drill 0.39)
  Top 0.178: IC1.32 25.82,8.79 25.82,7.99 24.42,6.59 24.42,5.84 23.28,4.69 22.07,4.69 v22.01,4.76 | v37.12,3.59 37.19,3.59 38.56,4.96 U4.7
  Bottom 0.178: v22.01,4.76 22.07,4.69 23.91,4.69 24.11,4.88 24.51,4.88 25.51,5.88 27.98,5.88 28.81,5.04 28.81,4.64 30.19,3.26 36.54,3.26 36.87,3.59 v37.12,3.59
NEO3V_6  (via drill 0.39)
  Top 0.178: IC1.34 26.64,6 25.53,4.89 25.15,4.89 v24.45,4.19 | v38.1,3.39 38.1,3.96 38.6,4.46 U4.8
  Bottom 0.178: v24.45,4.19 24.45,4.25 25.69,5.5 27.82,5.5 28.43,4.88 28.43,4.48 30.03,2.88 37.59,2.88 37.85,3.14 | v38.1,3.39 37.85,3.14 | 37.85,3.14
NEO3V_7  (via drill 0.39)
  Top 0.178: IC1.35 27.04,5.84 v25.43,4.22 | U4.9 39.12,3.92 v39.12,3.24
  Bottom 0.178: v25.43,4.22 25.46,4.22 26.36,5.12 27.66,5.12 28.05,4.73 28.05,4.3 29.84,2.5 38.76,2.5 39.12,2.86 v39.12,3.24
NEO4
  Top 0.178: R14.4 45.37,4.88 45.5,5.02 45.5,5.7 45.88,6.08 45.88,9.05 JP2.8
NEO5
  Top 0.178: R14.3 45.46,4.38 45.88,4.8 45.88,5.54 46.99,6.64 JP2.6
NEO6
  Top 0.178: R14.2 45.79,3.88 JP2.4
NEO7
  Top 0.178: R14.1 46.15,3.38 JP2.2
OUTVOLTAGE  (via drill 0.39)
  Top 0.203: v40.51,9.4 v40.51,9.39 U4.20
  Top 0.305: C19.1 40.74,8.64 40.51,8.41 U4.20
  Bottom 0.203: SJ1.2 40.51,10.54 v40.51,9.4
QSPI_CS
  Top 0.178: IC1.56 35.21,14.86 35.91,14.16 39.74,14.16 40.45,13.45 40.45,10.7 R11.1 40.18,10.42 U1.1 38.24,9.54 R5.1
QSPI_DATA[0]
  Top 0.178: IC1.53 34.73,13.65 35.42,12.96 U1.5
QSPI_DATA[1]
  Top 0.178: IC1.55 35.07,14.46 35.75,13.78 39.58,13.78 40.07,13.29 40.07,12.09 39.2,11.22 U1.2
QSPI_DATA[2]
  Top 0.178: IC1.54 34.93,14.06 35.59,13.4 39.42,13.4 39.69,13.13 39.69,12.51 39.69,12.26 39.45,12.02 U1.3
QSPI_DATA[3]
  Top 0.178: IC1.51 34.33,12.86 34.47,12.71 34.47,12.26 34.48,12.25 34.48,12.23 34.85,11.86 34.85,11.66 35.3,11.22 U1.7
QSPI_SCK
  Top 0.178: U1.6 35.23,12.02 34.86,12.39 34.86,12.41 34.85,12.41 34.85,12.99 34.59,13.26 IC1.52
RX  (via drill 0.39)
  Top 0.178: IC1.3 29.04,16.75 v29.46,17.18
  Bottom 0.178: v29.46,17.18 29.59,17.05 30.61,17.05 30.92,17.37 42.83,17.37 44.64,15.56 44.64,3.68 43.43,2.48 41.34,2.48 40.13,1.27 JP1.3
SCK  (via drill 0.39)
  Top 0.178: IC1.17 23.1,14.06 22.68,14.48 22.68,15.56 v22.04,16.19 | v32.07,6.45 32.32,6.45 32.83,5.94 32.83,2.35 JP1.6
  Bottom 0.178: v32.07,6.45 32,6.38 31.34,6.38 29.15,8.57 27.01,8.57 21.34,14.24 21.34,15.49 v22.04,16.19
SCL  (via drill 0.39)
  Top 0.178: IC1.5 28.24,17.5 29.73,18.99 32.42,18.99 33.16,19.72 35.06,19.72 35.5,20.17 37.45,20.17 37.83,20.55 40.8,20.55 JP3.11 | CONN1.4 42.73,14.76 44.83,16.85 44.83,18.73 v45.11,18.73
  Bottom 0.178: v45.11,18.73 44.83,18.73 JP3.11
SDA
  Top 0.178: IC1.4 28.64,17.34 29.91,18.61 32.58,18.61 33.32,19.34 35.22,19.34 35.66,19.79 37.6,19.79 37.95,20.13 40.96,20.13 41.34,20.51 42.33,20.51 43.47,21.65 JP3.12 44.45,17.08 42.62,15.25 41.68,15.25 41.18,15.76 CONN1.3
SWCLK  (via drill 0.39)
  Top 0.178: IC1.24 22.86,11.26 21.84,10.23 v21.56,10.23
  Bottom 0.203: TP2.P$1 21.59,10.27 v21.56,10.23
SWDIO  (via drill 0.39)
  Top 0.178: v22,9.32 22.26,9.57 22.26,10.11 23,10.86 IC1.25
  Bottom 0.203: TP1.P$1 21.59,8.91 v22,9.32
TX  (via drill 0.39)
  Top 0.178: IC1.2 29.44,16.28 29.67,16.51 29.74,16.51 30.36,17.13 v30.36,17.84
  Bottom 0.178: v30.36,17.84 30.45,17.75 42.99,17.75 45.02,15.71 45.02,3.46 42.83,1.27 JP1.2
USB_D+  (via drill 0.4)
  Top 0.178: 5.32,10.68 X6.B6 6.8,10.68 7.62,9.87 7.62,9.19 R10.1 | 5.32,10.68 5.21,10.79 5.21,11.56 5.39,11.74 6.09,11.74 X6.A6 | 5.32,10.68 1.92,10.68 D+1.TP
  other vias: 1.46,10.22
USB_D-  (via drill 0.4)
  Top 0.178: X6.A7 7.39,11.18 R9.1 6.97,12.18 X6.B7 2.04,12.18 D-1.TP
  other vias: 1.4,12.83
USBBOOT  (via drill 0.39)
  Top 0.178: IC1.9 26.64,18.13 v26.35,18.41 | D3.C 41.28,12.05 v41.28,13.71
  Top 0.203: SW2.A 35.07,15.9 35.47,15.3 v36.74,15.3 37.88,15.3 38.48,15.9 SW2.A'
  Bottom 0.178: v26.35,18.41 26.35,18.03 28.37,16.02 34.78,16.02 35.5,15.3 v36.74,15.3 36.74,15.01 38.04,13.71 v41.28,13.71
  Bottom 0.203: v36.74,15.3 36.7,15.27 TP3.P$1
VBAT
  Top 0.305: Q3.3 11.24,10.91 11.24,13.99 11.92,14.67 X1.2 11.92,15.86 14.22,18.16 C20.1 | JP3.1 16.51,20.64 15.88,20 C20.1 | C20.1 16.95,17.08 16.95,15.5 16.95,13.27 19.05,13.27 19.49,13.71 U3.3
VBUS  (via drill 0.4)
  Top 0.305: Q3.1 10.54,8.91 10.54,11.7 10.15,12.09 D4.A 10.06,12.19 10.06,12.2 9.09,13.17 9.09,13.96 8.97,14.09 7.68,14.09 | v4.34,13.46 5.19,13.46 5.51,13.79 6.11,13.79 X6.A4B9 6.68,13.83 6.93,14.09 7.68,14.09 | X6.B4A9 5.56,9.03 5.25,9.34 v3.75,9.34 3.75,7.43 2.48,6.16 1.47,6.16 1.03,5.71 CHG.A | v11.62,19.18 9.97,19.18 7.68,16.89 7.68,14.09 | JP3.3 21.59,21.27 20.7,20.38 20.7,17.74 R4.2 20.3,16.83 U3.4
  Bottom 0.305: v4.34,13.46 3.43,12.55 3.43,9.65 v3.75,9.34 | JP3.3 21.59,20.95 21.12,20.48 12.93,20.48 v11.62,19.18
VHI  (via drill 0.39)
  Top 0.203: R3.2 v18.96,12.51
  Top 0.305: 15.56,10.99 17.65,10.99 18.06,11.39 R3.2 | U2.1 15.56,10.99 | C1.1 13.84,10.6 12.32,9.08 Q3.2 | C1.1 13.95,12.1 D4.C | 15.56,10.99 14.34,10.99 C1.1
  Bottom 0.203: v18.96,12.51 19.47,12.51 20.53,13.57 21.36,13.57 26.75,8.18 28.93,8.18 31.41,5.69 34.55,5.69 35.34,6.48 35.34,7.22 38.86,10.74 SJ1.3

### Text on the board
bPlace: VLogic | 5 | 3 | In | Out | Direct